# Altium schematic sheet LCD.SchDoc
size A
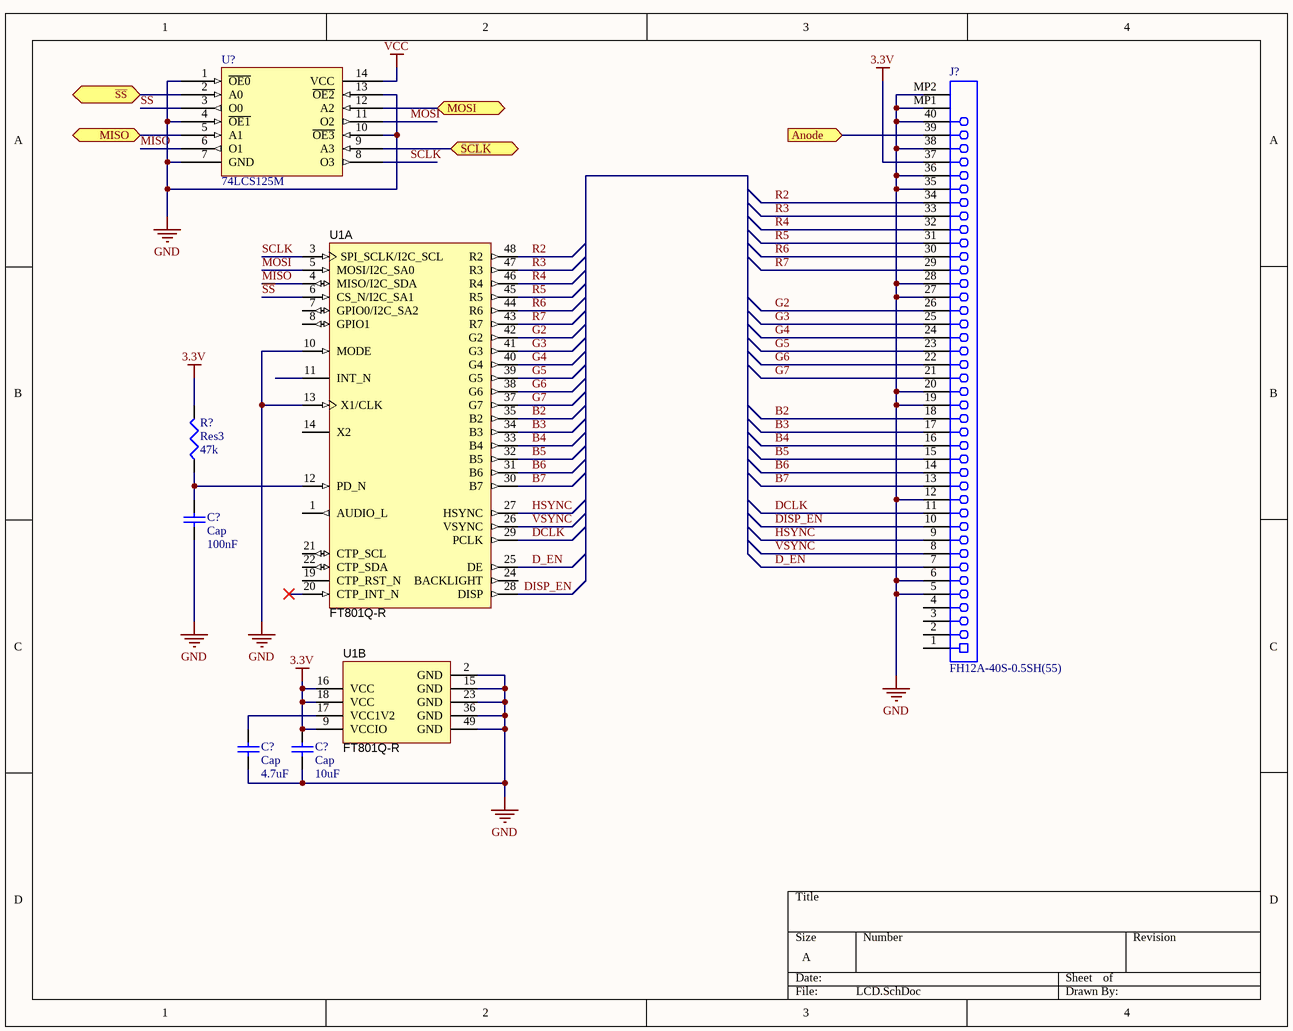
[diagram p0: LCD.SchDoc]

## Parts
(Parts that share a designator on the sheet are numbered #1, #2 ... from top to bottom, then left to right.)
C?#1  Cap  value 100nF  [C0805]
C?#2  Cap  value 10uF  [1608[0603]]
C?#3  Cap  value 4.7uF  [C0805]
J?  FH12A-40S-0.5SH(55)  [HIRO-FH12A-40S-0.5SH(55)_V]
R?  Res3  value 47k  [J1-0603]
U1  FT801Q-R  [WQFN-48]  (parts A,B of 2)
U?  74LCS125M  [SOIC127P780X210-14M]

## Ports
Anode (in), MISO (bidir), MOSI (bidir), SCLK (bidir), ~{SS} (bidir)

## Nets
3.3V: C?#2.1 J?.37 R?.2 U1.9(VCCIO) U1.16(VCC) U1.18(VCC)
GND: C?#1.1 C?#2.2 C?#3.1 J?.5 J?.6 J?.12 J?.19 J?.20 J?.27 J?.28 J?.35 J?.36 J?.38 J?.40 J?.MP1 J?.MP2 U1.2(GND) U1.10(MODE) U1.13(X1/CLK) U1.15(GND) U1.23(GND) U1.36(GND) U1.49(GND) U?.1(~{OE0}) U?.4(~{OE1}) U?.7(GND) U?.10(~{OE3}) U?.13(~{OE2})
VCC: U?.14(VCC)
Anode: J?.39 ; port Anode
B2: J?.18 U1.35(B2)
B3: J?.17 U1.34(B3)
B4: J?.16 U1.33(B4)
B5: J?.15 U1.32(B5)
B6: J?.14 U1.31(B6)
B7: J?.13 U1.30(B7)
D_EN: J?.7 U1.25(DE)
DCLK: J?.11 U1.29(PCLK)
DISP_EN: J?.10 U1.28(DISP)
G2: J?.26 U1.42(G2)
G3: J?.25 U1.41(G3)
G4: J?.24 U1.40(G4)
G5: J?.23 U1.39(G5)
G6: J?.22 U1.38(G6)
G7: J?.21 U1.37(G7)
HSYNC: J?.9 U1.27(HSYNC)
MISO: U1.4(MISO/I2C_SDA) U?.6(O1)
MISO: U?.5(A1) ; port MISO  [a separate net that carries the same name]
MOSI: U1.5(MOSI/I2C_SA0) U?.11(O2)
MOSI: U?.12(A2) ; port MOSI  [a separate net that carries the same name]
R2: J?.34 U1.48(R2)
R3: J?.33 U1.47(R3)
R4: J?.32 U1.46(R4)
R5: J?.31 U1.45(R5)
R6: J?.30 U1.44(R6)
R7: J?.29 U1.43(R7)
~{SS}: U1.6(CS_N/I2C_SA1) U?.3(O0)
~{SS}: U?.2(A0) ; port ~{SS}  [a separate net that carries the same name]
SCLK: U1.3(SPI_SCLK/I2C_SCL) U?.8(O3)
SCLK: U?.9(A3) ; port SCLK  [a separate net that carries the same name]
VSYNC: J?.8 U1.26(VSYNC)
NetC?#1_2: C?#1.2 R?.1 U1.12(PD_N)
NetC?#3_2: C?#3.2 U1.17(VCC1V2)

Not connected (* = marked no-connect by the designer): J? 1 2 3 4; U1 1(AUDIO_L) 7(GPIO0/I2C_SA2) 8(GPIO1) 11(INT_N) 14(X2) 19(CTP_RST_N) 20(CTP_INT_N)* 21(CTP_SCL) 22(CTP_SDA) 24(BACKLIGHT)

## Library data of the parts
C?#1-C?#3 = Cap: Capacitor; Published: 8-Jun-2000; LatestRevisionDate: 17-Jul-2002; LatestRevisionNote: Re-released for DXP Platform.; PackageReference: RAD-0.3; Publisher: Altium Limited; PackageDescription: Radial Cap, Thru-Hole; 2 Leads; 0.3 in Pin Spacing
J? = CMP-2000-06268-1: Flip Lock Conncetor for FPC/FFC, 1 x 40 Position, Pitch 0.5 mm, -40 to 70 degC, SMD, RoHS, Tape and Reel; Manufacturer: Hirose Electric; Pitch: 0.5mm; Style/Orientation: RightAngleSocket/Receptacle; No of Positions: 40; Package Description: Female Header, Pitch 0.5 mm, 1 x 40 Position, Height 2 mm; Datasheet Version: 10/2006; Termination: Solder; Manufacturer URL: https://www.hirose.com; Mounting Technology: SurfaceMount; Type: FFC/FPC; Package Reference: FH12A-40S-0.5SH(55); Datasheet URL: https://datasheet.ciiva.com/14667/0900766b80806912-14667338.pdf
R? = Res3: Resistor; Published: 8-Jun-2000; LatestRevisionDate: 29-May-2009; LatestRevisionNote: IPC-7351 Footprint Added.; PackageReference: J1-0603; Publisher: Altium Limited; PackageDescription: Chip Resistor
U1 = CMP-0582-00009-1: FT801 Single Chip Embedded Graphic Controller (Embedded Video Engine), -40 to +85 degC, 48-pin VQFN, Pb-Free, Tape and Reel; Manufacturer: FTDI; PackageReference: WQFN-48; ComponentLink1URL: http://www.ftdichip.com/; PackageDescription: 48-Pin Quad Flat No-Lead, 7 x 7 mm Body, 0.5 mm Pitch, 5.36 x 5.36 mm Exposed Pad; ComponentLink1Description: Manufacturer URL; ComponentLink2URL: http://www.ftdichip.com/Support/Documents/DataSheets/ICs/DS_FT801.pdf; DatasheetVersion: ver 1.0, Jul-2014; ComponentLink2Description: Datasheet
U? = 74LCS125M: Low Voltage Quad Buffer with 5V tolerant Inputs and Outputs; ComponentLink1Description: Digikey Link; ComponentLink1URL: https://www.digikey.com/product-detail/en/on-semiconductor/74LCX125MX/74LCX125MXCT-ND/965496